# Altium project Elkapod_power_supply.PrjPcb (part 2 of 6)

## Sheet StandBy_converter.SchDoc
size A4; SheetNumber: 5; SheetTotal: 10
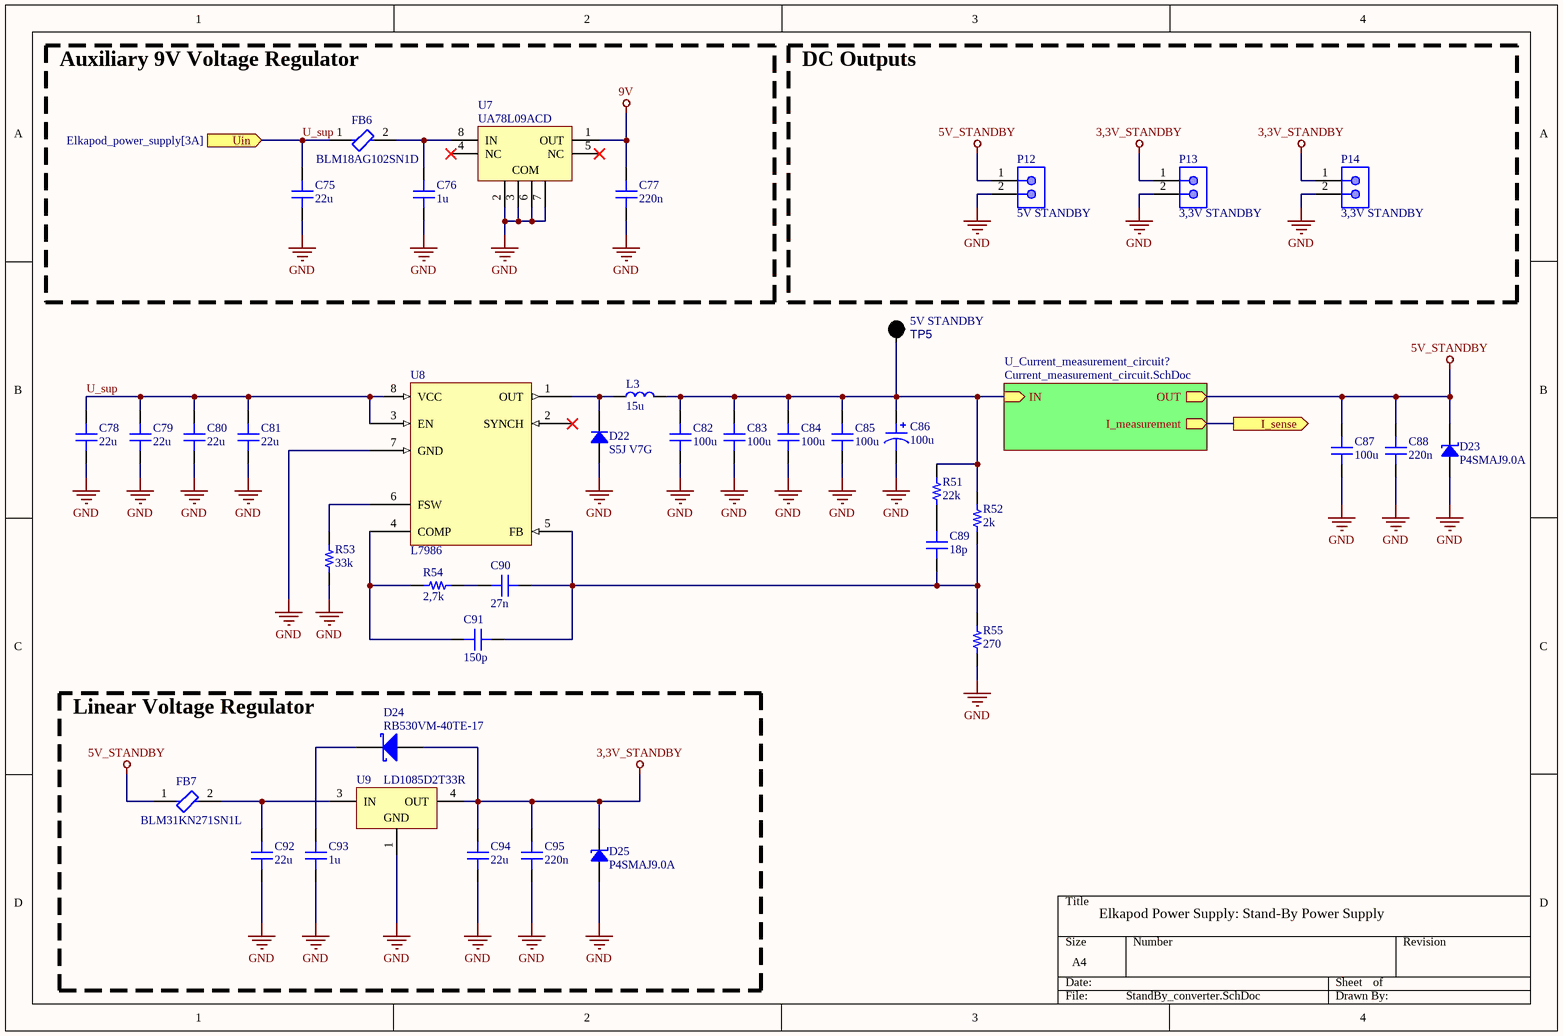
[diagram p3: StandBy_converter.SchDoc]

### Parts
C75  22u  [CAP 0805_2012]
C76  1u  [CAP 0603_1608]
C77  220n  [CAP 0603_1608]
C78  22u  [CAP 0805_2012]
C79  22u  [CAP 0805_2012]
C80  22u  [CAP 0805_2012]
C81  22u  [CAP 0805_2012]
C82  100u  [CAP 1210_3225 - 1MM]
C83  100u  [CAP 1210_3225 - 1MM]
C84  100u  [CAP 1210_3225 - 1MM]
C85  100u  [CAP 1210_3225 - 1MM]
C86  100u  [CAP ALSMD 8.3MM H10.5MM]
C87  100u  [CAP 1210_3225 - 1MM]
C88  220n  [CAP 0603_1608]
C89  18p  [CAP 0603_1608]
C90  27n  [CAP 0603_1608]
C91  150p  [CAP 0603_1608]
C92  22u  [CAP 0805_2012]
C93  1u  [CAP 0603_1608]
C94  22u  [CAP 0805_2012]
C95  220n  [CAP 0603_1608]
D22  S5J V7G  [DO214AB SMC]
D23  P4SMAJ9.0A  [DO214AC SMA]
D24  RB530VM-40TE-17  [SOD-323]
D25  P4SMAJ9.0A  [DO214AC SMA]
FB6  BLM18AG102SN1D  [FP-BLM18-0_15-t0_8-MFG]
FB7  BLM31KN271SN1L  [FP-BLM31-0_2-t1_6-d3_3-MFG]
L3  15u  [12,5x12,5_INDUCTOR]
P12  5V STANDBY  [MOLX-22-23-2021_V]
P13  3,3V STANDBY  [MOLX-22-23-2021_V]
P14  3,3V STANDBY  [MOLX-22-23-2021_V]
R51  22k  [RES 0603_1608]
R52  2k  [RES 0603_1608]
R53  33k  [RES 0603_1608]
R54  2,7k  [RES 0603_1608]
R55  270  [RES 0603_1608]
TP5  5V STANDBY  [Keystone_5006_BLACK]
U7  UA78L09ACD  [D0008A_N]
U8  L7986  [HSOP8_L]
U9  LD1085D2T33R  [TO-263_M]

### Blocks framed on the sheet
Auxiliary 9V Voltage Regulator: C75-C77 FB6 U7
DC Outputs: P12-P14
Linear Voltage Regulator: C92-C95 D24 D25 FB7 U9

### Sub-sheets
U_Current_measurement_circuit? = Current_measurement_circuit.SchDoc: I_measurement (out), IN (in), OUT (out)  | Rsense_value: 8m

### Ports
I_sense (out, see Elkapod_power_supply[4A]), Uin (in, see Elkapod_power_supply[3A])

### Nets
3,3V_STANDBY: C94.2 C95.2 D24.2(A) D25.2 P13.1 P14.1 U9.4(OUT)
5V_STANDBY: C87.2 C88.2 D23.2 FB7.1 P12.1 ; sheet U_Current_measurement_circuit?/OUT
9V: C77.2 U7.1(OUT)
GND: C75.1 C76.1 C77.1 C78.1 C79.1 C80.1 C81.1 C82.1 C83.1 C84.1 C85.1 C86.2 C87.1 C88.1 C92.1 C93.1 C94.1 C95.1 D22.1 D23.1 D25.1 P12.2 P13.2 P14.2 R53.1 R55.1 U7.2(GND) U7.3(GND) U7.6(GND) U7.7(GND) U8.7(GND) U9.1(GND)  [project net AGND]
I_STANDBY_SENSE: port I_sense, sheet U_Current_measurement_circuit?/I_measurement
U_sup: C75.2 C78.2 C79.2 C80.2 C81.2 FB6.1 U8.3(EN) U8.8(VCC) ; port Uin
NetC76_2: C76.2 FB6.2 U7.8(IN)
NetC82_2: C82.2 C83.2 C84.2 C85.2 C86.1 L3.2 R51.2 R52.2 TP5.0 ; sheet U_Current_measurement_circuit?/IN
NetC89_1: C89.1 C90.1 C91.1 R52.1 R55.2 U8.5(FB)
NetC89_2: C89.2 R51.1
NetC90_2: C90.2 R54.1
NetC91_2: C91.2 R54.2 U8.4(COMP)
NetC92_2: C92.2 FB7.2 U9.3(IN)
NetC93_2: C93.2 D24.1(K)
NetD22_2: D22.2 L3.1 U8.1(OUT)
NetR53_2: R53.2 U8.6(FSW)

Not connected (* = marked no-connect by the designer): U7 4(NC)* 5(NC)*; U8 2(SYNCH)*

### Notes on the sheet
- Elkapod Power Supply: Stand-By Power Supply
- (in symbol CMP-0324-00150-3) COM

### Library data of the parts
C75 C78-C81 C92 C94 = VJ0805Y684KXQTW1BC: CAP CER 22UF 25V X7R 0805; manufacturer: Vishay Vitramon; Tolerance: ±10%; Voltage - Rated: 10V; Part Number: VJ0805Y684KXQTW1BC; Value: 22u; Applications: General Purpose; Capacitance: 22u; componentlink1description: Datasheet; componentlink1url: https://www.vishay.com/docs/28548/vjw1bcbascomseries.pdf; componentlink2description: DigiKey Link; componentlink2url: https://www.digikey.com/en/products/detail/vishay-vitramon/VJ0805Y684KXQTW1BC/8313569; Device Package: 0805 (2012 Metric); lastupdated: 09.02.2024 20:13:13; Lifecycle Status: Active; Minimum Order: 1; Mounting Type: Surface Mount, MLCC; Operating Temperature: -55°C ~ 125°C; Package / Case: 0805 (2012 Metric); packaging: TapeAndReel; partid: 57262; price: 0.05; series: VJ W1BC; Size / Dimension: 0.079" L x 0.049" W (2.00mm x 1.25mm); Temperature Coefficient: X7R; Thickness (Max): 0.053" (1.35mm)
C76 C93 = C0603C272F3GAC7867: CAP CER 1uF 25V X5R 0603; manufacturer: KEMET; Temperature Coefficient: C0G, NP0; Tolerance: ±1%; Part Number: C0603C272F3GAC7867; Value: 1u; Applications: General Purpose; Capacitance: 1u; componentlink1description: Datasheet; componentlink1url: https://api.kemet.com/component-edge/download/datasheet/C0603C272F3GACTU.pdf; componentlink2description: DigiKey Link; componentlink2url: https://www.digikey.com/en/products/detail/kemet/C0603C272F3GAC7867/2200413; Device Package: 0603 (1608 Metric); Features: Low ESL; lastupdated: 09.02.2024 20:10:30; Lifecycle Status: Active; Minimum Order: 1; Mounting Type: Surface Mount, MLCC; Operating Temperature: -55°C ~ 125°C; Package / Case: 0603 (1608 Metric); packaging: TapeAndReel; partid: 2138; Part Status: Active; price: 0.40; series: SMD Comm C0G; Size / Dimension: 0.063" L x 0.031" W (1.60mm x 0.80mm); Thickness (Max): 0.034" (0.87mm); Voltage - Rated: 25V
C77 C88 C95 = C0603C272F3GAC7867: CAP CER 220nF 25V X5R 0603; manufacturer: KEMET; Temperature Coefficient: C0G, NP0; Tolerance: ±1%; Part Number: C0603C272F3GAC7867; Value: 220n; Applications: General Purpose; Capacitance: 220n; componentlink1description: Datasheet; componentlink1url: https://api.kemet.com/component-edge/download/datasheet/C0603C272F3GACTU.pdf; componentlink2description: DigiKey Link; componentlink2url: https://www.digikey.com/en/products/detail/kemet/C0603C272F3GAC7867/2200413; Device Package: 0603 (1608 Metric); Features: Low ESL; lastupdated: 09.02.2024 20:10:30; Lifecycle Status: Active; Minimum Order: 1; Mounting Type: Surface Mount, MLCC; Operating Temperature: -55°C ~ 125°C; Package / Case: 0603 (1608 Metric); packaging: TapeAndReel; partid: 2138; Part Status: Active; price: 0.40; series: SMD Comm C0G; Size / Dimension: 0.063" L x 0.031" W (1.60mm x 0.80mm); Thickness (Max): 0.034" (0.87mm); Voltage - Rated: 25V
C82-C85 C87 = CAN13X104KARAC7800: CAP CER 1210 100UF 10V X7R; manufacturer: KEMET; Tolerance: ±10%; Voltage - Rated: 250VAC; Part Number: CAN13X104KARAC7800; Value: 100u; Applications: Boardflex Sensitive; Capacitance: 100u; componentlink1description: Datasheet; componentlink1url: //media.digikey.com/pdf/Data%20Sheets/Kemet%20PDFs/CAN13X104KARACTU_Spec.pdf; componentlink2description: DigiKey Link; componentlink2url: https://www.digikey.com/en/products/detail/kemet/CAN13X104KARAC7800/9962480; Device Package: 1210 (3225 Metric); Features: Low ESL, Soft Termination; lastupdated: 04.06.2024 19:21:07; Lifecycle Status: Active; Minimum Order: 1; Mounting Type: Surface Mount, MLCC; Operating Temperature: -55°C ~ 125°C; Package / Case: 1210 (3225 Metric); packaging: TapeAndReel; partid: 23615; Part Status: Active; price: 0.39; series: CAN SMD Indust X7R; Size / Dimension: 0.130" L x 0.102" W (3.30mm x 2.60mm); Temperature Coefficient: X7R; Thickness (Max): 0.110" (2.80mm)
C86 = EEE-TC1C101P: UCD1V101MNL1GS; CAP ALUM 100UF 20% 16V SMD; value: 100u
C89 = C0603C272F3GAC7867: CAP CER 18pF 50V G0C 0603; manufacturer: KEMET; Temperature Coefficient: C0G, NP0; Tolerance: ±1%; Voltage - Rated: 25V; Part Number: C0603C272F3GAC7867; Value: 18p; Applications: General Purpose; Capacitance: 18p; componentlink1description: Datasheet; componentlink1url: https://api.kemet.com/component-edge/download/datasheet/C0603C272F3GACTU.pdf; componentlink2description: DigiKey Link; componentlink2url: https://www.digikey.com/en/products/detail/kemet/C0603C272F3GAC7867/2200413; Device Package: 0603 (1608 Metric); Features: Low ESL; lastupdated: 09.02.2024 20:10:30; Lifecycle Status: Active; Minimum Order: 1; Mounting Type: Surface Mount, MLCC; Operating Temperature: -55°C ~ 125°C; Package / Case: 0603 (1608 Metric); packaging: TapeAndReel; partid: 2138; Part Status: Active; price: 0.40; series: SMD Comm C0G; Size / Dimension: 0.063" L x 0.031" W (1.60mm x 0.80mm); Thickness (Max): 0.034" (0.87mm)
C90 = C0603C272F3GAC7867: CAP CER 27nF 50V G0C 0603; manufacturer: KEMET; Temperature Coefficient: C0G, NP0; Tolerance: ±1%; Voltage - Rated: 25V; Part Number: C0603C272F3GAC7867; Value: 27n; Applications: General Purpose; Capacitance: 27n; componentlink1description: Datasheet; componentlink1url: https://api.kemet.com/component-edge/download/datasheet/C0603C272F3GACTU.pdf; componentlink2description: DigiKey Link; componentlink2url: https://www.digikey.com/en/products/detail/kemet/C0603C272F3GAC7867/2200413; Device Package: 0603 (1608 Metric); Features: Low ESL; lastupdated: 09.02.2024 20:10:30; Lifecycle Status: Active; Minimum Order: 1; Mounting Type: Surface Mount, MLCC; Operating Temperature: -55°C ~ 125°C; Package / Case: 0603 (1608 Metric); packaging: TapeAndReel; partid: 2138; Part Status: Active; price: 0.40; series: SMD Comm C0G; Size / Dimension: 0.063" L x 0.031" W (1.60mm x 0.80mm); Thickness (Max): 0.034" (0.87mm)
C91 = C0603C272F3GAC7867: CAP CER 150pF 50V G0C 0603; manufacturer: KEMET; Temperature Coefficient: C0G, NP0; Tolerance: ±1%; Voltage - Rated: 25V; Part Number: C0603C272F3GAC7867; Value: 150p; Applications: General Purpose; Capacitance: 150p; componentlink1description: Datasheet; componentlink1url: https://api.kemet.com/component-edge/download/datasheet/C0603C272F3GACTU.pdf; componentlink2description: DigiKey Link; componentlink2url: https://www.digikey.com/en/products/detail/kemet/C0603C272F3GAC7867/2200413; Device Package: 0603 (1608 Metric); Features: Low ESL; lastupdated: 09.02.2024 20:10:30; Lifecycle Status: Active; Minimum Order: 1; Mounting Type: Surface Mount, MLCC; Operating Temperature: -55°C ~ 125°C; Package / Case: 0603 (1608 Metric); packaging: TapeAndReel; partid: 2138; Part Status: Active; price: 0.40; series: SMD Comm C0G; Size / Dimension: 0.063" L x 0.031" W (1.60mm x 0.80mm); Thickness (Max): 0.034" (0.87mm)
D22 = S5J V7G: DIODE GEN PURP 600V 5A DO214AB; Manufacturer: Taiwan Semiconductor Corporation; Capacitance @ Vr, F: 60pF @ 4V, 1MHz; Current - Reverse Leakage @ Vr: 10µA @ 600V; Diode Type: Standard; Reverse Recovery Time (trr): 1.5µs; Speed: Standard Recovery >500ns, > 200mA (Io); Voltage - Forward (Vf) (Max) @ If: 1.15V @ 5A; Part Number: S5J V7G; ComponentLink1Description: Datasheet; ComponentLink1URL: https://www.taiwansemi.com/products/datasheet/S5A%20SERIES_D1708.pdf; ComponentLink2Description: DigiKey Link; ComponentLink2URL: http://digikey.com/product-detail/en/taiwan-semiconductor-corporation/S5J-V7G/S5JV7GCT-ND/7944428; Current - Average Rectified (Io): 5A; LastUpdated: 03.06.2024 19:54:16; Lifecycle Status: Active; Minimum Order: 1; Mounting Type: Surface Mount; Operating Temperature - Junction: -55°C ~ 150°C; Package / Case: DO-214AB, SMC; Packaging: TapeAndReel; PartId: 335; Part Status: Active; Price: 0.21; Series: -; Supplier 1: DigiKey; Supplier Part Number 1: S5JV7GCT-ND; Supplier Device Package: DO-214AB (SMC); Voltage - DC Reverse (Vr) (Max): 600V
D23 D25 = SMA6J18A-TP: TVS DIODE 9VDC DO214AC; Part Number: P4SMAJ9.0A
D24 = BAS140W: Schottky diode; 0,1A; 40V; Published: 21-Mar-2003; LatestRevisionDate: 19-Mar-2004; LatestRevisionNote: Silkscreen size reduced.; DatasheetDocument: Oct-1999; PackageDocument: Sep-2000; PackageReference: SOD-323; Publisher: Altium Limited; ComponentLink1Description: Manufacturer Link; ComponentLink1URL: http://www.infineon.com/; ComponentLink2Description: Datasheet; ComponentLink2URL: http://www.infineon.com/upload/Document/cmc_upload/documents/009/386/bas70_bas170series_1.pdf
FB6 = CMP-0686-00457-3: Chip Ferrite Bead, 0603, 1000Ω @ 100MHz, 0.5Ω, 25%, 450mA; Number of Circuits: 1; Max DC Current: 400mA; Shielding: Unshielded; DC Resistance (DCR): 500mR; Material: Steel; DC Resistance-Max: 700mR; Impedance: 1kR; Case Code (Imperial): 0603; Max Current Rating: 400mA; Frequency: 100MHz; Min Operating Temperature: -55°C; Case/Package: 0603; Depth: 0.8mm; Lead Free: Lead Free; Core Material: Ferrite; Current Rating: 400mA; Resistance: 500mR; Case Code (Metric): 1608; DC Current: 400mA; Package Quantity: 1; Packaging: Tape and Reel; Width: 0.8mm; Military Standard: Not; Height: 0.8mm; Series: BLM18A; Max Operating Temperature: 125°C; Tolerance: 25%; Termination: SMD/SMT; Test Frequency: 100MHz; Number of Lines: 1; Number of Pins: 2; REACH SVHC: No SVHC; Length: 1.6mm; Radiation Hardening: No
FB7 = CMP-06046-002074-1: Chip Ferrite Bead, 1206, 270Ω @ 100MHz, 0.016Ω, 25%, 4.5A; DC Resistance (DCR): 16mR; Number of Lines: 1; Mount: Surface Mount; Case Code (Imperial): 1206; Case/Package: 1206; Packaging: Cut Tape; Min Operating Temperature: -55°C; Max Current Rating: 4.5A; Case Code (Metric): 3216; Max Operating Temperature: 125°C
L3 = 12,5x12,5_INDUCTOR: SMD power inductor; Imax = 4,27A; Isat = 5,69A
P12-P14 = CMP-1704-00001-3: Male Header, Pitch 2.54 mm, 1 x 2 Position, Height 10.67 mm, Tail Length 3.56 mm, 0 to 75 degC, RoHS, Bulk; Package Quantity: 3000; Height: 10.67 mm; RoHSCompliant: True; ComponentLink2URL: https://datasheet.ciiva.com/19454/232266-19454304.pdf; PartNumber: 22-23-2021; Packaging: Bulk; ComponentLink2Description: Datasheet; Min Operating Temperature: 0 degC; ComponentLink1Description: Manufacturer URL; Length: 5.08 mm; Mounting Technology: Through Hole; Max Operating Temperature: 75 degC; REACH SVHC: Unknown; PackageDescription: Male Header, Pitch 2.54 mm, 1 x 2 Position, Height 10.67 mm, Tail Length 3.56 mm; ComponentLink1URL: http://www.molex.com/; Mount: Through Hole; Radiation Hardening: No; Width: 6.35 mm; Pins: 2
R51 = RNCS0603BKE10K0: RES 22K OHM 1% 0,1W 0603; Manufacturer: Stackpole Electronics Inc; Power (Watts): 0.063W, 1/16W; Temperature Coefficient: ±25ppm/°C; Tolerance: ±0.1%; Part Number: RNCS0603BKE10K0; Value: 22k; Composition: Thin Film; Device Package: 0603 (1608 Metric); Features: Anti-Corrosive, Automotive AEC-Q200, Moisture Resistant; Height - Seated (Max): 0.022" (0.55mm); LastUpdated: 09.02.2024 20:43:37; Lifecycle Status: Active; Minimum Order: 1; Number of Terminations: 2; Operating Temperature: -55°C ~ 155°C; Package / Case: 0603 (1608 Metric); Packaging: TapeAndReel; PartId: 4838; Part Status: Active; Price: 0.06; Ratings: AEC-Q200; Resistance: 22k; Series: RNCS; Size / Dimension: 0.061" L x 0.031" W (1.55mm x 0.80mm); Supplier Device Package: 0603
R52 = RNCS0603BKE10K0: RES 2K OHM 1% 0,1W 0603; Manufacturer: Stackpole Electronics Inc; Power (Watts): 0.063W, 1/16W; Temperature Coefficient: ±25ppm/°C; Tolerance: ±0.1%; Part Number: RNCS0603BKE10K0; Value: 2k; Composition: Thin Film; Device Package: 0603 (1608 Metric); Features: Anti-Corrosive, Automotive AEC-Q200, Moisture Resistant; Height - Seated (Max): 0.022" (0.55mm); LastUpdated: 09.02.2024 20:43:37; Lifecycle Status: Active; Minimum Order: 1; Number of Terminations: 2; Operating Temperature: -55°C ~ 155°C; Package / Case: 0603 (1608 Metric); Packaging: TapeAndReel; PartId: 4838; Part Status: Active; Price: 0.06; Ratings: AEC-Q200; Resistance: 2k; Series: RNCS; Size / Dimension: 0.061" L x 0.031" W (1.55mm x 0.80mm); Supplier Device Package: 0603
R53 = RNCS0603BKE10K0: RES 33K OHM 1% 0,1W 0603; Manufacturer: Stackpole Electronics Inc; Power (Watts): 0.063W, 1/16W; Temperature Coefficient: ±25ppm/°C; Tolerance: ±0.1%; Part Number: RNCS0603BKE10K0; Value: 33k; Composition: Thin Film; Device Package: 0603 (1608 Metric); Features: Anti-Corrosive, Automotive AEC-Q200, Moisture Resistant; Height - Seated (Max): 0.022" (0.55mm); LastUpdated: 09.02.2024 20:43:37; Lifecycle Status: Active; Minimum Order: 1; Number of Terminations: 2; Operating Temperature: -55°C ~ 155°C; Package / Case: 0603 (1608 Metric); Packaging: TapeAndReel; PartId: 4838; Part Status: Active; Price: 0.06; Ratings: AEC-Q200; Resistance: 33k; Series: RNCS; Size / Dimension: 0.061" L x 0.031" W (1.55mm x 0.80mm); Supplier Device Package: 0603
R54 = RNCS0603BKE10K0: RES 2,7K OHM 1% 0,1W 0603; Manufacturer: Stackpole Electronics Inc; Power (Watts): 0.063W, 1/16W; Temperature Coefficient: ±25ppm/°C; Tolerance: ±0.1%; Part Number: RNCS0603BKE10K0; Value: 2,7k; Composition: Thin Film; Device Package: 0603 (1608 Metric); Features: Anti-Corrosive, Automotive AEC-Q200, Moisture Resistant; Height - Seated (Max): 0.022" (0.55mm); LastUpdated: 09.02.2024 20:43:37; Lifecycle Status: Active; Minimum Order: 1; Number of Terminations: 2; Operating Temperature: -55°C ~ 155°C; Package / Case: 0603 (1608 Metric); Packaging: TapeAndReel; PartId: 4838; Part Status: Active; Price: 0.06; Ratings: AEC-Q200; Resistance: 2,7k; Series: RNCS; Size / Dimension: 0.061" L x 0.031" W (1.55mm x 0.80mm); Supplier Device Package: 0603
R55 = RNCS0603BKE10K0: RES 270 OHM 1% 0,1W 0603; Manufacturer: Stackpole Electronics Inc; Power (Watts): 0.063W, 1/16W; Temperature Coefficient: ±25ppm/°C; Tolerance: ±0.1%; Part Number: RNCS0603BKE10K0; Value: 270; Composition: Thin Film; Device Package: 0603 (1608 Metric); Features: Anti-Corrosive, Automotive AEC-Q200, Moisture Resistant; Height - Seated (Max): 0.022" (0.55mm); LastUpdated: 09.02.2024 20:43:37; Lifecycle Status: Active; Minimum Order: 1; Number of Terminations: 2; Operating Temperature: -55°C ~ 155°C; Package / Case: 0603 (1608 Metric); Packaging: TapeAndReel; PartId: 4838; Part Status: Active; Price: 0.06; Ratings: AEC-Q200; Resistance: 270; Series: RNCS; Size / Dimension: 0.061" L x 0.031" W (1.55mm x 0.80mm); Supplier Device Package: 0603
TP5 = Keystone 5006 Test Point: Keystone 5006 Test Point (BLACK)
U7 = CMP-0324-00150-3: Fixed Regulator with 11.5 to 24 V Input and 9 V Output, 0 to 125 degC, 8-Pin SOIC (D), Green (RoHS & no Sb/Br); Manufacturer: Texas Instruments; Vout(Min)(V): 9; Vdo(Typ)(V): 1.7; Iq(Typ)(mA): 6; Vin(Max)(V): 24; Iout(Max)(A): 0.1; Vin(Min)(V): 11.5; Vout(Max)(V): 9; ComponentLink2URL: http://www.ti.com/litv/pdf/msoi002j; Eco-Plan: Green (RoHS & no Sb/Br); ComponentLink2Description: Package Specification; DatasheetVersion: SLVS010S; PackageDescription: 8-Pin Plastic Small Outline Integrated Circuit, 4.9 x 3.9 mm, Pitch 1.27 mm Pitch; ComponentLink3URL: Samples URL:http://www.ti.com/product/ua78l09a#samples; PackageReference: D0008A; PartNumber: UA78L09ACD; Mounting Technology: Surface Mount; ComponentLink1Description: Datasheet; Code_JEDEC: MS-012AA; ComponentLink3Description: URL Link1; PackageVersion: revM, Jun-2011; ComponentLink1URL: http://www.ti.com/general/docs/lit/getliterature.tsp?genericPartNumber=UA78L09A&fileType=pdf
U8 = L7986: 3 A step-down switching regulator; HSOP8
U9 = CMP-0244-00169-1: 3A, Low Drop Positive Voltage Regulator, 3.3V, 3-Pin D2PAK; ComponentLink1URL: http://www.st.com; PackageVersion: 2011; ComponentLink1Description: Manufacturer URL; ComponentLink2URL: http://www.st.com/internet/com/TECHNICAL_RESOURCES/TECHNICAL_LITERATURE/DATASHEET/CD00001883.pdf; PackageDescription: 3-Pin Transistor Outline Package 2.54 mm Pitch, 15.4 mm Lead Span (D2PAK); DatasheetVersion: 28/07/2009; ComponentLink2Description: Datasheet; PackageReference: TO-263

## Sheet Servos_controller.SchDoc
size A4; SheetNumber: 8; SheetTotal: 10
Used 3 times, as channels U_Servos_controller, U_Servos_controller, U_Servos_controller. Parts and nets are listed once, with the designators drawn on the sheet.
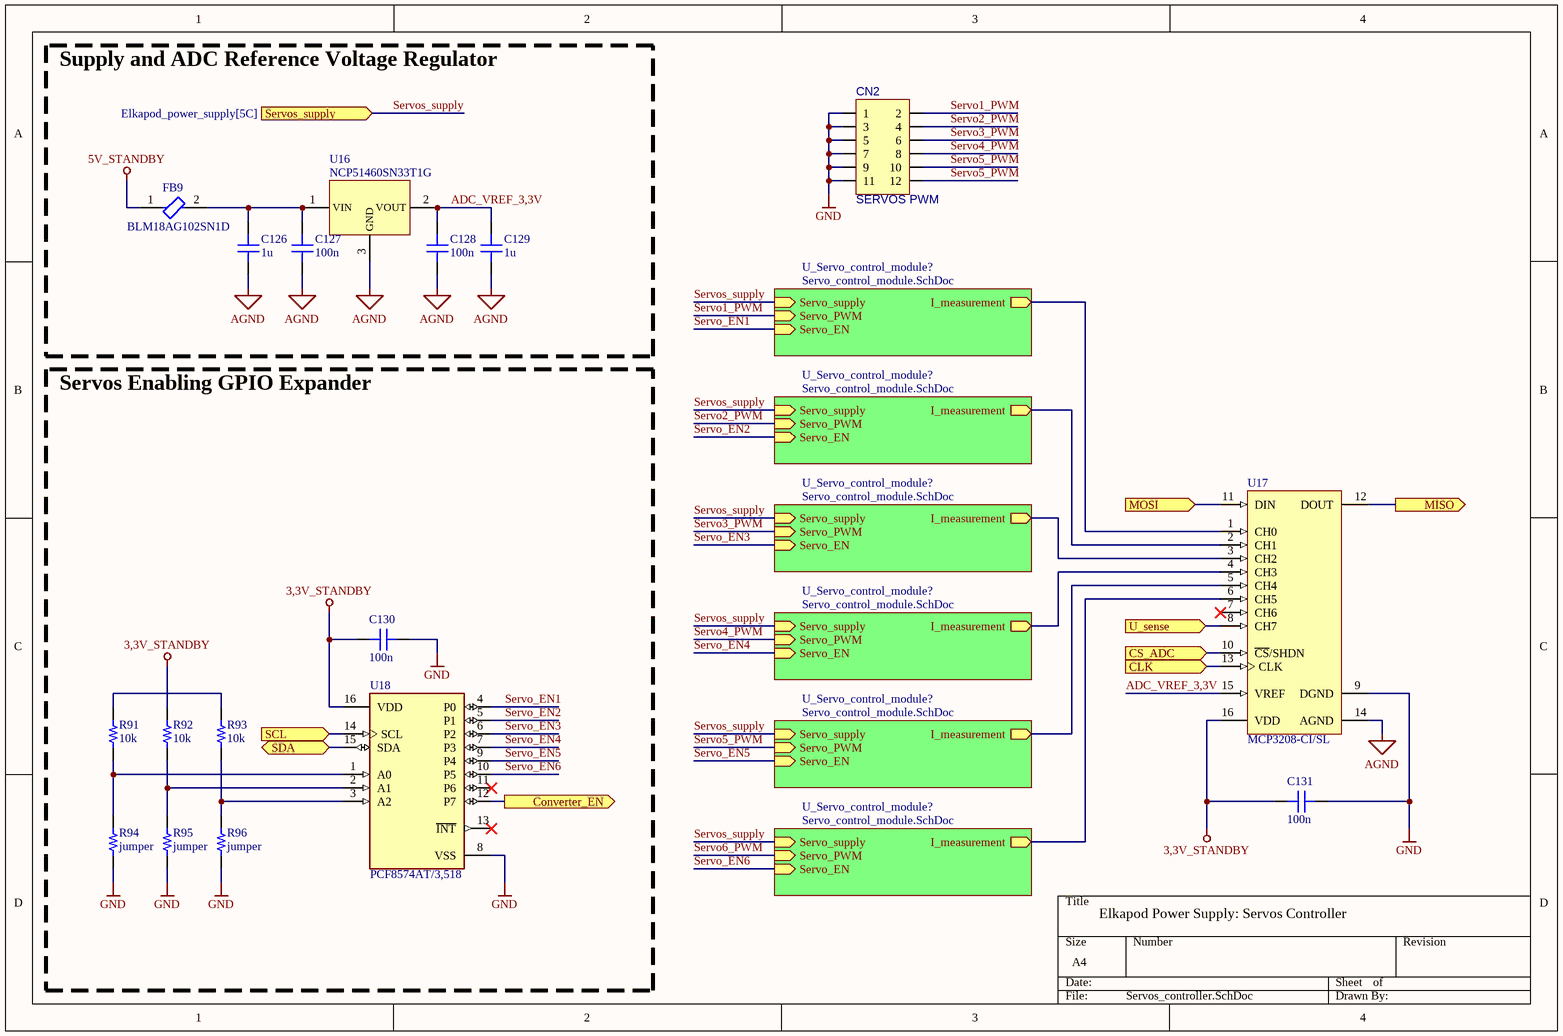
[diagram p4: Servos_controller.SchDoc]

### Parts
C126  1u  [CAP 0603_1608]
C127  100n  [CAP 0603_1608]
C128  100n  [CAP 0603_1608]
C129  1u  [CAP 0603_1608]
C130  100n  [CAP 0603_1608]
C131  100n  [CAP 0603_1608]
CN2  SERVOS PWM  [IDC12]
FB9  BLM18AG102SN1D  [FP-BLM18-0_15-t0_8-MFG]
R91  10k  [RES 0603_1608]
R92  10k  [RES 0603_1608]
R93  10k  [RES 0603_1608]
R94  value jumper  [RES 0603_1608]  (hidden comment: A0_jumper)
R95  value jumper  [RES 0603_1608]  (hidden comment: A1_jumper)
R96  value jumper  [RES 0603_1608]  (hidden comment: A2_jumper)
U16  NCP51460SN33T1G  [SOT23-3]
U17  MCP3208-CI/SL  [SOIC-SL16_M]
U18  PCF8574AT/3,518  [FP-SOT162-1-MFG]

### Blocks framed on the sheet
Supply and ADC Reference Voltage Regulator: C126-C129 FB9 U16
Servos Enabling GPIO Expander: C130 R91-R96 U18

### Sub-sheets
U_Servo_control_module? = Servo_control_module.SchDoc: Servo_supply (in), Servo_PWM (in), I_measurement (out), Servo_EN (in)
U_Servo_control_module? = Servo_control_module.SchDoc: Servo_supply (in), Servo_PWM (in), I_measurement (out), Servo_EN (in)
U_Servo_control_module? = Servo_control_module.SchDoc: Servo_supply (in), Servo_PWM (in), I_measurement (out), Servo_EN (in)
U_Servo_control_module? = Servo_control_module.SchDoc: Servo_supply (in), Servo_PWM (in), I_measurement (out), Servo_EN (in)
U_Servo_control_module? = Servo_control_module.SchDoc: Servo_supply (in), Servo_PWM (in), I_measurement (out), Servo_EN (in)
U_Servo_control_module? = Servo_control_module.SchDoc: Servo_supply (in), Servo_PWM (in), I_measurement (out), Servo_EN (in)

### Ports
CLK (in, see Elkapod_power_supply[5C]), Converter_EN (out, see Elkapod_power_supply[5C]), CS_ADC (in, see Elkapod_power_supply[5C]), MISO (out, see Elkapod_power_supply[5C], Logic_controller[1D]), MOSI (in, see Elkapod_power_supply[5C], Logic_controller[1D]), SCL (in, see Elkapod_power_supply[5C], Controllable_voltage_outputs[2A], Electronics_power_supply_DC_converter[7C], Logic_controller[1D], Servos_DC_converter[5A]), SDA (bidir, see Elkapod_power_supply[5C], Controllable_voltage_outputs[2B], Electronics_power_supply_DC_converter[7C], Logic_controller[1D], Servos_DC_converter[5A]), Servos_supply (in, see Elkapod_power_supply[5C]), U_sense (in, see Elkapod_power_supply[5C])

### Nets
3,3V_STANDBY: C130.2 C131.2 R92.1 U17.16(VDD) U18.16(VDD)
5V_STANDBY: FB9.1
AGND: C126.1 C127.1 C128.1 C129.1 U16.3(GND) U17.14(AGND)
GND: C130.1 C131.1 CN2.1 CN2.3 CN2.5 CN2.7 CN2.9 CN2.11 R94.2 R95.2 R96.2 U17.9(DGND) U18.8(VSS)
ADC_VREF_3,3V: C128.2 C129.2 U16.2(VOUT) U17.15(VREF)  [project net ADC_VREF_3,3V_8]
CLK: U17.13(CLK) ; port CLK
Converter_EN: U18.12(P7) ; port Converter_EN
CS_ADC: U17.10(~{CS}/SHDN) ; port CS_ADC
MISO: U17.12(DOUT) ; port MISO
MOSI: U17.11(DIN) ; port MOSI
SCL: U18.14(SCL) ; port SCL
SDA: U18.15(SDA) ; port SDA
Servo1_PWM: CN2.2 ; sheet U_Servo_control_module?/Servo_PWM
Servo2_PWM: CN2.4 ; sheet U_Servo_control_module?/Servo_PWM
Servo3_PWM: CN2.6 ; sheet U_Servo_control_module?/Servo_PWM
Servo4_PWM: CN2.8 ; sheet U_Servo_control_module?/Servo_PWM
Servo5_PWM: CN2.10 CN2.12 ; sheet U_Servo_control_module?/Servo_PWM
Servo_EN1: U18.4(P0) ; sheet U_Servo_control_module?/Servo_EN
Servo_EN2: U18.5(P1) ; sheet U_Servo_control_module?/Servo_EN
Servo_EN3: U18.6(P2) ; sheet U_Servo_control_module?/Servo_EN
Servo_EN4: U18.7(P3) ; sheet U_Servo_control_module?/Servo_EN
Servo_EN5: U18.9(P4) ; sheet U_Servo_control_module?/Servo_EN
Servo_EN6: U18.10(P5) ; sheet U_Servo_control_module?/Servo_EN
Servos_supply: port Servos_supply, sheet U_Servo_control_module?/Servo_supply, sheet U_Servo_control_module?/Servo_supply, sheet U_Servo_control_module?/Servo_supply, sheet U_Servo_control_module?/Servo_supply, sheet U_Servo_control_module?/Servo_supply, sheet U_Servo_control_module?/Servo_supply
U_sense: U17.8(CH7) ; port U_sense
NetC126_2: C126.2 C127.2 FB9.2 U16.1(VIN)
NetR91_1: R91.1 R93.1
NetR91_2: R91.2 R94.1 U18.1(A0)
NetR92_2: R92.2 R95.1 U18.2(A1)
NetR93_2: R93.2 R96.1 U18.3(A2)
NetU17_1: U17.1(CH0) ; sheet U_Servo_control_module?/I_measurement
NetU17_2: U17.2(CH1) ; sheet U_Servo_control_module?/I_measurement
NetU17_3: U17.3(CH2) ; sheet U_Servo_control_module?/I_measurement
NetU17_4: U17.4(CH3) ; sheet U_Servo_control_module?/I_measurement
NetU17_5: U17.5(CH4) ; sheet U_Servo_control_module?/I_measurement
NetU17_6: U17.6(CH5) ; sheet U_Servo_control_module?/I_measurement

Not connected (* = marked no-connect by the designer): U17 7(CH6)*; U18 11(P6)* 13(~{INT})*

### Channels
U_Servos_controller: designators end in _1; ports CLK=SCK Converter_EN=NetR39_1_1 CS_ADC=CS1 MISO=MISO MOSI=MOSI SCL=SCL SDA=SDA Servos_supply=servo_converter_Vout U_sense=NetC72_1#2_2
U_Servos_controller: designators end in _2; ports CLK=SCK Converter_EN=NetR39_2_1 CS_ADC=CS2 MISO=MISO MOSI=MOSI SCL=SCL SDA=SDA Servos_supply=servo_converter_Vout U_sense=NetC72_2#2_2
U_Servos_controller: designators end in _3; ports CLK=SCK Converter_EN=NetR39_3_1 CS_ADC=CS3 MISO=MISO MOSI=MOSI SCL=SCL SDA=SDA Servos_supply=servo_converter_Vout U_sense=NetC72_3#2_2

### Notes on the sheet
- Elkapod Power Supply: Servos Controller

### Library data of the parts
C126 C129 = C0603C272F3GAC7867: CAP CER 1uF 16V X5R 0603; manufacturer: KEMET; Temperature Coefficient: C0G, NP0; Tolerance: ±1%; Voltage - Rated: 25V; Part Number: C0603C272F3GAC7867; Value: 1u; Applications: General Purpose; Capacitance: 1u; componentlink1description: Datasheet; componentlink1url: https://api.kemet.com/component-edge/download/datasheet/C0603C272F3GACTU.pdf; componentlink2description: DigiKey Link; componentlink2url: https://www.digikey.com/en/products/detail/kemet/C0603C272F3GAC7867/2200413; Device Package: 0603 (1608 Metric); Features: Low ESL; lastupdated: 09.02.2024 20:10:30; Lifecycle Status: Active; Minimum Order: 1; Mounting Type: Surface Mount, MLCC; Operating Temperature: -55°C ~ 125°C; Package / Case: 0603 (1608 Metric); packaging: TapeAndReel; partid: 2138; Part Status: Active; price: 0.40; series: SMD Comm C0G; Size / Dimension: 0.063" L x 0.031" W (1.60mm x 0.80mm); Thickness (Max): 0.034" (0.87mm)
C127 C128 C130 C131 = C0603C272F3GAC7867: CAP CER 100nF 25V X5R 0603; manufacturer: KEMET; Temperature Coefficient: C0G, NP0; Tolerance: ±1%; Part Number: C0603C272F3GAC7867; Value: 100n; Applications: General Purpose; Capacitance: 100n; componentlink1description: Datasheet; componentlink1url: https://api.kemet.com/component-edge/download/datasheet/C0603C272F3GACTU.pdf; componentlink2description: DigiKey Link; componentlink2url: https://www.digikey.com/en/products/detail/kemet/C0603C272F3GAC7867/2200413; Device Package: 0603 (1608 Metric); Features: Low ESL; lastupdated: 09.02.2024 20:10:30; Lifecycle Status: Active; Minimum Order: 1; Mounting Type: Surface Mount, MLCC; Operating Temperature: -55°C ~ 125°C; Package / Case: 0603 (1608 Metric); packaging: TapeAndReel; partid: 2138; Part Status: Active; price: 0.40; series: SMD Comm C0G; Size / Dimension: 0.063" L x 0.031" W (1.60mm x 0.80mm); Thickness (Max): 0.034" (0.87mm); Voltage - Rated: 25V
CN2 = CN_6x2
FB9 = CMP-0686-00457-3: as FB6 on sheet StandBy_converter; Case Code (Imperial): 0603; Max Current Rating: 400mA; Frequency: 100MHz; Min Operating Temperature: -55°C; Case/Package: 0603; Depth: 0.8mm; Lead Free: Lead Free; Core Material: Ferrite; Current Rating: 400mA; Resistance: 500mR; Case Code (Metric): 1608; DC Current: 400mA; Package Quantity: 1; Packaging: Tape and Reel; Width: 0.8mm; Military Standard: Not; Height: 0.8mm; Series: BLM18A; Max Operating Temperature: 125°C; Tolerance: 25%; Termination: SMD/SMT; Test Frequency: 100MHz; Number of Lines: 1; Number of Pins: 2; REACH SVHC: No SVHC; Length: 1.6mm; Radiation Hardening: No
R91-R93 = RNCS0603BKE10K0: RES 10K OHM 1% 0,1W 0603; Manufacturer: Stackpole Electronics Inc; Power (Watts): 0.063W, 1/16W; Temperature Coefficient: ±25ppm/°C; Tolerance: ±0.1%; Part Number: RNCS0603BKE10K0; Value: 10k; Composition: Thin Film; Device Package: 0603 (1608 Metric); Features: Anti-Corrosive, Automotive AEC-Q200, Moisture Resistant; Height - Seated (Max): 0.022" (0.55mm); LastUpdated: 09.02.2024 20:43:37; Lifecycle Status: Active; Minimum Order: 1; Number of Terminations: 2; Operating Temperature: -55°C ~ 155°C; Package / Case: 0603 (1608 Metric); Packaging: TapeAndReel; PartId: 4838; Part Status: Active; Price: 0.06; Ratings: AEC-Q200; Resistance: 10k; Series: RNCS; Size / Dimension: 0.061" L x 0.031" W (1.55mm x 0.80mm); Supplier Device Package: 0603
R94-R96 = RNCS0603BKE10K0: RES 0 OHM 1% 0,1W 0603; Manufacturer: Stackpole Electronics Inc; Power (Watts): 0.063W, 1/16W; Resistance: 0; Temperature Coefficient: ±25ppm/°C; Tolerance: ±0.1%; Part Number: RNCS0603BKE10K0; Composition: Thin Film; Device Package: 0603 (1608 Metric); Features: Anti-Corrosive, Automotive AEC-Q200, Moisture Resistant; Height - Seated (Max): 0.022" (0.55mm); LastUpdated: 09.02.2024 20:43:37; Lifecycle Status: Active; Minimum Order: 1; Number of Terminations: 2; Operating Temperature: -55°C ~ 155°C; Package / Case: 0603 (1608 Metric); Packaging: TapeAndReel; PartId: 4838; Part Status: Active; Price: 0.06; Ratings: AEC-Q200; Series: RNCS; Size / Dimension: 0.061" L x 0.031" W (1.55mm x 0.80mm); Supplier Device Package: 0603
U16 = NCP51460SN33T1G: Low power precision voltage reference; Iout = 20mA
U17 = CMP-0188-00449-2: 2.7V 4-Channel/8-Channel 12-Bit A/D Converters with SPI Serial Interface, 16-Pin SOIC 150mil, C Performance Grade, Industrial Temperature; PackageVersion: revBB, Aug-2009; ComponentLink2Description: Datasheet; Code_JEDEC: MS-012-AC; Code_IPC: SOIC127P600-16; ComponentLink1Description: Manufacturer URL; ComponentLink3URL: http://www.microchip.com/stellent/groups/techpub_sg/documents/packagingspec/en012702.pdf; PackageDescription: 16-Lead Plastic Small Outline (SL) - Narrow, 3.90mm Body [SOIC]; PackageReference: SOIC-SL16; DatasheetVersion: revE, Sep-2008; RevisionNote: URLs added.; ComponentLink1URL: http://www.microchip.com/; ComponentLink3Description: Package Specification; ComponentLink2URL: http://ww1.microchip.com/downloads/en/DeviceDoc/21298e.pdf
U18 = CMP-10112-000003-1: IC I/O EXPANDER I2C 8B 16SOIC; Manufacturer: NXP Semiconductors; Interface: I2C,SMBus; Frequency: 100kHz; Nominal Supply Current: 40uA; Max Supply Voltage: 6V; Number Of I/Os: 8; Max Junction Temp: +125°C; Min Supply Voltage: 2.5V; Standoff Height: 0.1mm; RoHS: TRUE; Category: IC; Temperature: -40°C to +85°C; Device Class L3: I/O Expanders; ComponentLink2Description: Datasheet; ComponentLink2URL: https://www.nxp.com/docs/en/data-sheet/PCF8574_PCF8574A.pdf; Digikey Description: IC I/O EXPANDER I2C 8B 16SOIC; Ipc Land Pattern Name: SOIC127P1032X265-16; Mouser Description: PCF8574 Series 2.5 to 6V Remote 8-bit I/O Expander for I2C-bus -SOIC-16; Footprint Url: https://www.nxp.com/docs/en/package-information/SOT162-1.pdf; Lead Free: Yes; Device Class L2: Interface ICs; Ambient Temperature Range Low: -40°C; Temperature Range High: +85°C; Automotive: No; Manufacturer Part Number: PCF8574AT/3,518; Ambient Temperature Range High: +85°C; Height: 2.65mm; Package: SOT162-1; Temperature Range Low: -40°C; Octopart: https://octopart.com/pcf8574at%2F3%2C518-nxp+semiconductors-11541925; Device Class L1: Integrated Circuits (ICs)

## Sheet Servo_control_module.SchDoc
size A4; SheetNumber: 9; SheetTotal: 10
Used 18 times, as channels U_Servos_controller/U_Servo_control_module?, U_Servos_controller/U_Servo_control_module?, U_Servos_controller/U_Servo_control_module?, U_Servos_controller/U_Servo_control_module?, U_Servos_controller/U_Servo_control_module?, U_Servos_controller/U_Servo_control_module?, U_Servos_controller/U_Servo_control_module?, U_Servos_controller/U_Servo_control_module?, U_Servos_controller/U_Servo_control_module?, U_Servos_controller/U_Servo_control_module?, U_Servos_controller/U_Servo_control_module?, U_Servos_controller/U_Servo_control_module?, U_Servos_controller/U_Servo_control_module?, U_Servos_controller/U_Servo_control_module?, U_Servos_controller/U_Servo_control_module?, U_Servos_controller/U_Servo_control_module?, U_Servos_controller/U_Servo_control_module?, U_Servos_controller/U_Servo_control_module?. Parts and nets are listed once, with the designators drawn on the sheet.
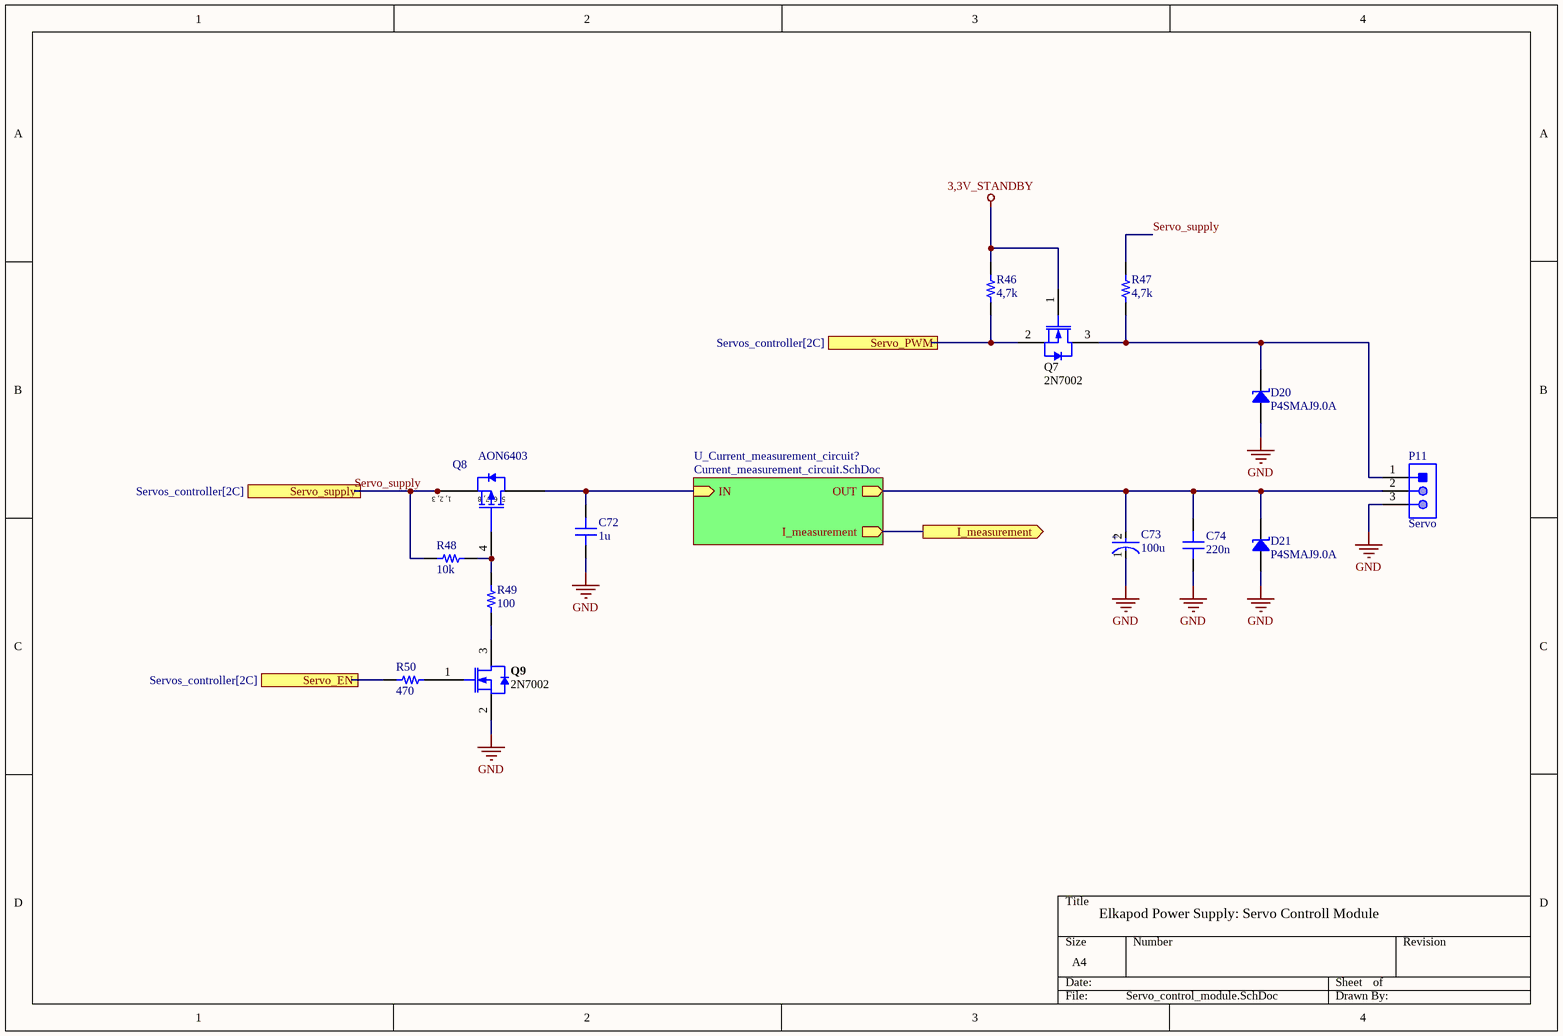
[diagram p5: Servo_control_module.SchDoc]

### Parts
C72  1u  [CAP 0603_1608]
C73  100u  [FP-FKE-MFG]
C74  220n  [CAP 0603_1608]
D20  P4SMAJ9.0A  [DO214AC SMA]
D21  P4SMAJ9.0A  [DO214AC SMA]
P11  Servo  [MOLX-22-23-2031_V]
Q7  2N7002  [INF-PG-SOT23_M]
Q8  AON6403  [DFN5x6]
Q9  2N7002  [INF-PG-SOT23_M]
R46  4,7k  [RES 0603_1608]
R47  4,7k  [RES 0603_1608]
R48  10k  [RES 0603_1608]
R49  100  [RES 0603_1608]
R50  470  [RES 0603_1608]

### Sub-sheets
U_Current_measurement_circuit? = Current_measurement_circuit.SchDoc: I_measurement (out), IN (in), OUT (out)  | Rsense_value: 8m

### Ports
I_measurement (out, see Servos_controller[3C], Current_measurement_circuit[3B]), Servo_EN (in, see Servos_controller[2C]), Servo_PWM (in, see Servos_controller[2C]), Servo_supply (in, see Servos_controller[2C])

### Nets
3,3V_STANDBY: Q7.1(GATE) R46.2
GND: C72.1 C73.1(C) C74.2 D20.1 D21.1 P11.3 Q9.2(SOURCE)
I_measurement: port I_measurement, sheet U_Current_measurement_circuit?/I_measurement
Servo_EN: R50.2 ; port Servo_EN
Servo_PWM: Q7.2(SOURCE) R46.1 ; port Servo_PWM
Servo_supply: Q8.1(S) Q8.2(S) Q8.3(S) R47.2 R48.1 ; port Servo_supply
NetC72_2: C72.2 Q8.5-6-7-8(D) ; sheet U_Current_measurement_circuit?/IN
NetC73_2: C73.2(A) C74.1 D21.2 P11.2 ; sheet U_Current_measurement_circuit?/OUT
NetD20_2: D20.2 P11.1 Q7.3(DRAIN) R47.1
NetQ8_4: Q8.4(G) R48.2 R49.2
NetQ9_1: Q9.1(GATE) R50.1
NetQ9_3: Q9.3(DRAIN) R49.1

### Channels
U_Servos_controller/U_Servo_control_module?: designators C72=C72_1#1 C73=C73_1#1 C74=C74_1 D20=D20_1 D21=D21_1 P11=P11_1 Q7=Q7_1#1 Q8=Q8_1#1 Q9=Q9_1 R46=R46_1#1 R47=R47_1#1 R48=R48_1#1 R49=R49_1#1 R50=R50_1#1; ports I_measurement=NetC136_3_2 Servo_EN=Servo_EN1_U_Servos_controller Servo_PWM=Servo1_PWM_U_Servos_controller Servo_supply=servo_converter_Vout
U_Servos_controller/U_Servo_control_module?: designators C72=C72_2#1 C73=C73_2#1 C74=C74_2 D20=D20_2 D21=D21_2 P11=P11_2 Q7=Q7_2#1 Q8=Q8_2#1 Q9=Q9_2 R46=R46_2#1 R47=R47_2#1 R48=R48_2#1 R49=R49_2#1 R50=R50_2#1; ports I_measurement=NetC136_4_2 Servo_EN=Servo_EN2_U_Servos_controller Servo_PWM=Servo2_PWM_U_Servos_controller Servo_supply=servo_converter_Vout
U_Servos_controller/U_Servo_control_module?: designators C72=C72_3#1 C73=C73_3#1 C74=C74_3 D20=D20_3 D21=D21_3 P11=P11_3 Q7=Q7_3#1 Q8=Q8_3#1 Q9=Q9_3 R46=R46_3#1 R47=R47_3#1 R48=R48_3#1 R49=R49_3#1 R50=R50_3#1; ports I_measurement=NetC136_5_2 Servo_EN=Servo_EN3_U_Servos_controller Servo_PWM=Servo3_PWM_U_Servos_controller Servo_supply=servo_converter_Vout
U_Servos_controller/U_Servo_control_module?: designators C72=C72_4#1 C73=C73_4#1 C74=C74_4 D20=D20_4 D21=D21_4 P11=P11_4 Q7=Q7_4#1 Q8=Q8_4#1 Q9=Q9_4 R46=R46_4#1 R47=R47_4#1 R48=R48_4#1 R49=R49_4#1 R50=R50_4#1; ports I_measurement=NetC136_6_2 Servo_EN=Servo_EN4_U_Servos_controller Servo_PWM=Servo4_PWM_U_Servos_controller Servo_supply=servo_converter_Vout
U_Servos_controller/U_Servo_control_module?: designators end in _5; ports I_measurement=NetC136_7_2 Servo_EN=Servo_EN5_U_Servos_controller Servo_PWM=Servo5_PWM_U_Servos_controller Servo_supply=servo_converter_Vout
U_Servos_controller/U_Servo_control_module?: designators end in _6; ports I_measurement=NetC136_8_2 Servo_EN=Servo_EN6_U_Servos_controller Servo_PWM=Servo6_PWM_U_Servos_controller Servo_supply=servo_converter_Vout
U_Servos_controller/U_Servo_control_module?: designators end in _7; ports I_measurement=NetC136_12_2 Servo_EN=Servo_EN1_U_Servos_controller Servo_PWM=Servo1_PWM_U_Servos_controller Servo_supply=servo_converter_Vout
U_Servos_controller/U_Servo_control_module?: designators end in _8; ports I_measurement=NetC136_13_2 Servo_EN=Servo_EN2_U_Servos_controller Servo_PWM=Servo2_PWM_U_Servos_controller Servo_supply=servo_converter_Vout
U_Servos_controller/U_Servo_control_module?: designators end in _9; ports I_measurement=NetC136_14_2 Servo_EN=Servo_EN3_U_Servos_controller Servo_PWM=Servo3_PWM_U_Servos_controller Servo_supply=servo_converter_Vout
U_Servos_controller/U_Servo_control_module?: designators end in _10; ports I_measurement=NetC136_15_2 Servo_EN=Servo_EN4_U_Servos_controller Servo_PWM=Servo4_PWM_U_Servos_controller Servo_supply=servo_converter_Vout
U_Servos_controller/U_Servo_control_module?: designators end in _11; ports I_measurement=NetC136_16_2 Servo_EN=Servo_EN5_U_Servos_controller Servo_PWM=Servo5_PWM_U_Servos_controller Servo_supply=servo_converter_Vout
U_Servos_controller/U_Servo_control_module?: designators end in _12; ports I_measurement=NetC136_17_2 Servo_EN=Servo_EN6_U_Servos_controller Servo_PWM=Servo6_PWM_U_Servos_controller Servo_supply=servo_converter_Vout
U_Servos_controller/U_Servo_control_module?: designators end in _13; ports I_measurement=NetC136_18_2 Servo_EN=Servo_EN1_U_Servos_controller Servo_PWM=Servo1_PWM_U_Servos_controller Servo_supply=servo_converter_Vout
U_Servos_controller/U_Servo_control_module?: designators end in _14; ports I_measurement=NetC136_19_2 Servo_EN=Servo_EN2_U_Servos_controller Servo_PWM=Servo2_PWM_U_Servos_controller Servo_supply=servo_converter_Vout
U_Servos_controller/U_Servo_control_module?: designators end in _15; ports I_measurement=NetC136_20_2 Servo_EN=Servo_EN3_U_Servos_controller Servo_PWM=Servo3_PWM_U_Servos_controller Servo_supply=servo_converter_Vout
U_Servos_controller/U_Servo_control_module?: designators end in _16; ports I_measurement=NetC136_21_2 Servo_EN=Servo_EN4_U_Servos_controller Servo_PWM=Servo4_PWM_U_Servos_controller Servo_supply=servo_converter_Vout
U_Servos_controller/U_Servo_control_module?: designators end in _17; ports I_measurement=NetC136_22_2 Servo_EN=Servo_EN5_U_Servos_controller Servo_PWM=Servo5_PWM_U_Servos_controller Servo_supply=servo_converter_Vout
U_Servos_controller/U_Servo_control_module?: designators end in _18; ports I_measurement=NetC136_23_2 Servo_EN=Servo_EN6_U_Servos_controller Servo_PWM=Servo6_PWM_U_Servos_controller Servo_supply=servo_converter_Vout

### Notes on the sheet
- Elkapod Power Supply: Servo Controll Module
- (in symbol AON6403) 1, 2, 3; 5, 6, 7, 8
- (in symbol CMP-2000-06205-2) +

### Library data of the parts
C72 = C0603C272F3GAC7867: as C126 on sheet Servos_controller; Part Number: C0603C272F3GAC7867; Value: 1u; Applications: General Purpose; Capacitance: 1u; componentlink1description: Datasheet; componentlink1url: https://api.kemet.com/component-edge/download/datasheet/C0603C272F3GACTU.pdf; componentlink2description: DigiKey Link; componentlink2url: https://www.digikey.com/en/products/detail/kemet/C0603C272F3GAC7867/2200413; Device Package: 0603 (1608 Metric); Features: Low ESL; lastupdated: 09.02.2024 20:10:30; Lifecycle Status: Active; Minimum Order: 1; Mounting Type: Surface Mount, MLCC; Operating Temperature: -55°C ~ 125°C; Package / Case: 0603 (1608 Metric); packaging: TapeAndReel; partid: 2138; Part Status: Active; price: 0.40; series: SMD Comm C0G; Size / Dimension: 0.063" L x 0.031" W (1.60mm x 0.80mm); Thickness (Max): 0.034" (0.87mm)
C73 = CMP-2000-06205-2: CAP ALUM 100UF 20% 25V SMD; Ripple Current (AC): 300mA; Leakage Current: 3uA; Dielectric Material: Aluminium; Impedance: 260mR; Life (Hours): 2000Hour; Max Operating Temperature: 105°C; Voltage Rating (DC): 25V; Packaging: Tape and Reel; Min Operating Temperature: -55°C; Capacitance: 100uF; Ripple Current: 300mA; Mount: Surface Mount; Lead Free: Lead Free; Construction: Cylindrical; Voltage Rating: 25V; RoHS Compliant: Yes; Case/Package: Radial; Height: 6.2mm; Tolerance: 20%; Diameter: 8mm; Termination: SMD/SMT; Package Quantity: 1; Width: 8.3mm; REACH SVHC: No SVHC; Series: FK; Number of Pins: 2; Voltage: 25V; Radiation Hardening: No; Height - Seated (Max): 0.244inch; Length: 6.2mm; ESR (Equivalent Series Resistance): 260mR
C74 = C0603C272F3GAC7867: as C77 on sheet StandBy_converter; Part Number: C0603C272F3GAC7867; Value: 220n; Applications: General Purpose; Capacitance: 220n; componentlink1description: Datasheet; componentlink1url: https://api.kemet.com/component-edge/download/datasheet/C0603C272F3GACTU.pdf; componentlink2description: DigiKey Link; componentlink2url: https://www.digikey.com/en/products/detail/kemet/C0603C272F3GAC7867/2200413; Device Package: 0603 (1608 Metric); Features: Low ESL; lastupdated: 09.02.2024 20:10:30; Lifecycle Status: Active; Minimum Order: 1; Mounting Type: Surface Mount, MLCC; Operating Temperature: -55°C ~ 125°C; Package / Case: 0603 (1608 Metric); packaging: TapeAndReel; partid: 2138; Part Status: Active; price: 0.40; series: SMD Comm C0G; Size / Dimension: 0.063" L x 0.031" W (1.60mm x 0.80mm); Thickness (Max): 0.034" (0.87mm); Voltage - Rated: 25V
D20 D21 = SMA6J18A-TP: TVS DIODE 9VDC DO214AC; Part Number: P4SMAJ9.0A
P11 = CMP-2000-05242-1: Male Header, Pitch 2.54 mm, 1 x 3 Position, Height 8.18 mm, Tail Length 3.56 mm, RoHS, Bulk; Current Rating: 4A; Brand: Molex; Pitch: 2.54mm; Voltage Rating: 250V; Mounting Angle: Vertical; Type: Locking; Factory Pack Quantity: 16000; Tradename: KK; Housing Material: Nylon; Contact Material: Brass; Manufacturer URL: http://www.molex.com/; Termination Style: ThroughHole; Mounting Style: ThroughHole; Number of Positions: 3Position; Contact Gender: Pin(Male); Packaging: Bulk; Series: 6373; Datasheet Version: Sep-01; Contact Plating: Tin; Product: Headers; Datasheet URL: https://datasheet.ciiva.com/19472/232274-19472863.pdf; RoHS: Details; Product Category: Headers&WireHousings; Manufacturer: Molex; Number of Rows: 1Row
Q7 Q9 = CMP-1149-00026-1: N-Channel OptiMOS Small-Signal-Transistor, 60 V VDS, 0.3 A ID, -55 to 150 degC, PG-SOT23, Reel, Green; Manufacturer: Infineon; RDS (on) (max) (@4.5V): 4,000 mOhm; VDS (max): 60 V; IDpuls (max): 1.2Â A; QG: 0.4Â nC; RDS (on) (max): 3,000 mOhm; RthJA (max): 250 K/W; ID (max): 0.3Â A; VGS(th) (max): 2.5Â V; VGS(th) (min): 1.5Â V; Green: TRUE; Ptot (max): 0.5Â W; PackageDescription: 3-Pin Small Outline Transistor Package, 2.9 x 1.3 mm Body, 0.95 mm Pitch; Halogen-free: TRUE; ComponentLink2Description: Datasheet; ComponentLink1URL: http://www.infineon.com/; Packing: Reel; DatasheetVersion: Rev. 2.4; PartNumber: 2N7002; PackageReference: PG-SOT23; PackageVersion: Apr-08; ComponentLink3URL: http://www.infineon.com/dgdl/SOT23-Package_Overview.pdf?folderId=db3a30431936bc4b0119532290053c66&fileId=db3a30431936bc4b0119533468123c85; ComponentLink1Description: Manufacturer URL; Mounting Technology: Surface Mount; ComponentLink3Description: Package Specification; ComponentLink2URL: http://www.infineon.com/dgdl/2N7002_Rev2.4.pdf?folderId=db3a3043156fd573011622e10b5c1f67&fileId=db3a304319bc939a0119c2a9461e79e6
Q8 = AON6403: P-MOSFET; 67A; 30V; DFN5x6
R46 R47 = RNCS0603BKE10K0: RES 4,7K OHM 1% 0,1W 0603; Manufacturer: Stackpole Electronics Inc; Power (Watts): 0.063W, 1/16W; Temperature Coefficient: ±25ppm/°C; Tolerance: ±0.1%; Part Number: RNCS0603BKE10K0; Value: 4,7k; Composition: Thin Film; Device Package: 0603 (1608 Metric); Features: Anti-Corrosive, Automotive AEC-Q200, Moisture Resistant; Height - Seated (Max): 0.022" (0.55mm); LastUpdated: 09.02.2024 20:43:37; Lifecycle Status: Active; Minimum Order: 1; Number of Terminations: 2; Operating Temperature: -55°C ~ 155°C; Package / Case: 0603 (1608 Metric); Packaging: TapeAndReel; PartId: 4838; Part Status: Active; Price: 0.06; Ratings: AEC-Q200; Resistance: 4,7k; Series: RNCS; Size / Dimension: 0.061" L x 0.031" W (1.55mm x 0.80mm); Supplier Device Package: 0603
R48 = RNCS0603BKE10K0: as R91 on sheet Servos_controller; Part Number: RNCS0603BKE10K0; Value: 10k; Composition: Thin Film; Device Package: 0603 (1608 Metric); Features: Anti-Corrosive, Automotive AEC-Q200, Moisture Resistant; Height - Seated (Max): 0.022" (0.55mm); LastUpdated: 09.02.2024 20:43:37; Lifecycle Status: Active; Minimum Order: 1; Number of Terminations: 2; Operating Temperature: -55°C ~ 155°C; Package / Case: 0603 (1608 Metric); Packaging: TapeAndReel; PartId: 4838; Part Status: Active; Price: 0.06; Ratings: AEC-Q200; Resistance: 10k; Series: RNCS; Size / Dimension: 0.061" L x 0.031" W (1.55mm x 0.80mm); Supplier Device Package: 0603
R49 = RNCS0603BKE10K0: RES 100 OHM 1% 0,1W 0603; Manufacturer: Stackpole Electronics Inc; Power (Watts): 0.063W, 1/16W; Temperature Coefficient: ±25ppm/°C; Tolerance: ±0.1%; Part Number: RNCS0603BKE10K0; Value: 100; Composition: Thin Film; Device Package: 0603 (1608 Metric); Features: Anti-Corrosive, Automotive AEC-Q200, Moisture Resistant; Height - Seated (Max): 0.022" (0.55mm); LastUpdated: 09.02.2024 20:43:37; Lifecycle Status: Active; Minimum Order: 1; Number of Terminations: 2; Operating Temperature: -55°C ~ 155°C; Package / Case: 0603 (1608 Metric); Packaging: TapeAndReel; PartId: 4838; Part Status: Active; Price: 0.06; Ratings: AEC-Q200; Resistance: 100; Series: RNCS; Size / Dimension: 0.061" L x 0.031" W (1.55mm x 0.80mm); Supplier Device Package: 0603
R50 = RNCS0603BKE10K0: RES 470 OHM 1% 0,1W 0603; Manufacturer: Stackpole Electronics Inc; Power (Watts): 0.063W, 1/16W; Temperature Coefficient: ±25ppm/°C; Tolerance: ±0.1%; Part Number: RNCS0603BKE10K0; Value: 470; Composition: Thin Film; Device Package: 0603 (1608 Metric); Features: Anti-Corrosive, Automotive AEC-Q200, Moisture Resistant; Height - Seated (Max): 0.022" (0.55mm); LastUpdated: 09.02.2024 20:43:37; Lifecycle Status: Active; Minimum Order: 1; Number of Terminations: 2; Operating Temperature: -55°C ~ 155°C; Package / Case: 0603 (1608 Metric); Packaging: TapeAndReel; PartId: 4838; Part Status: Active; Price: 0.06; Ratings: AEC-Q200; Resistance: 470; Series: RNCS; Size / Dimension: 0.061" L x 0.031" W (1.55mm x 0.80mm); Supplier Device Package: 0603